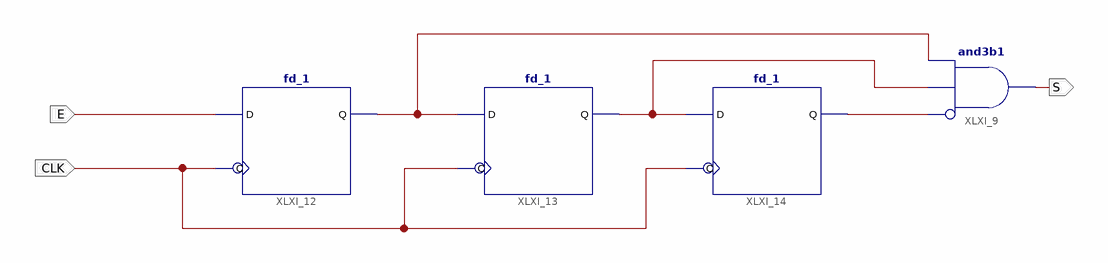
[diagram p0: schematic sheet 1]
// Xilinx ISE schematic schema1tpo.sch (artix7) as structural Verilog: 4 symbols, 3 ports
module schema1tpo (
  input  E,
  input  CLK,
  output S
);

  wire XLXN_23, XLXN_24, XLXN_25;

  and XLXI_9 (S, ~XLXN_25, XLXN_23, XLXN_24);  // and3b1
  fd_1 XLXI_12 (.C(CLK), .D(E), .Q(XLXN_24));
  fd_1 XLXI_13 (.C(CLK), .D(XLXN_24), .Q(XLXN_23));
  fd_1 XLXI_14 (.C(CLK), .D(XLXN_23), .Q(XLXN_25));
endmodule
